# EAGLE design 8x8matrix_tlc_alt (EAGLE 6.5.0)
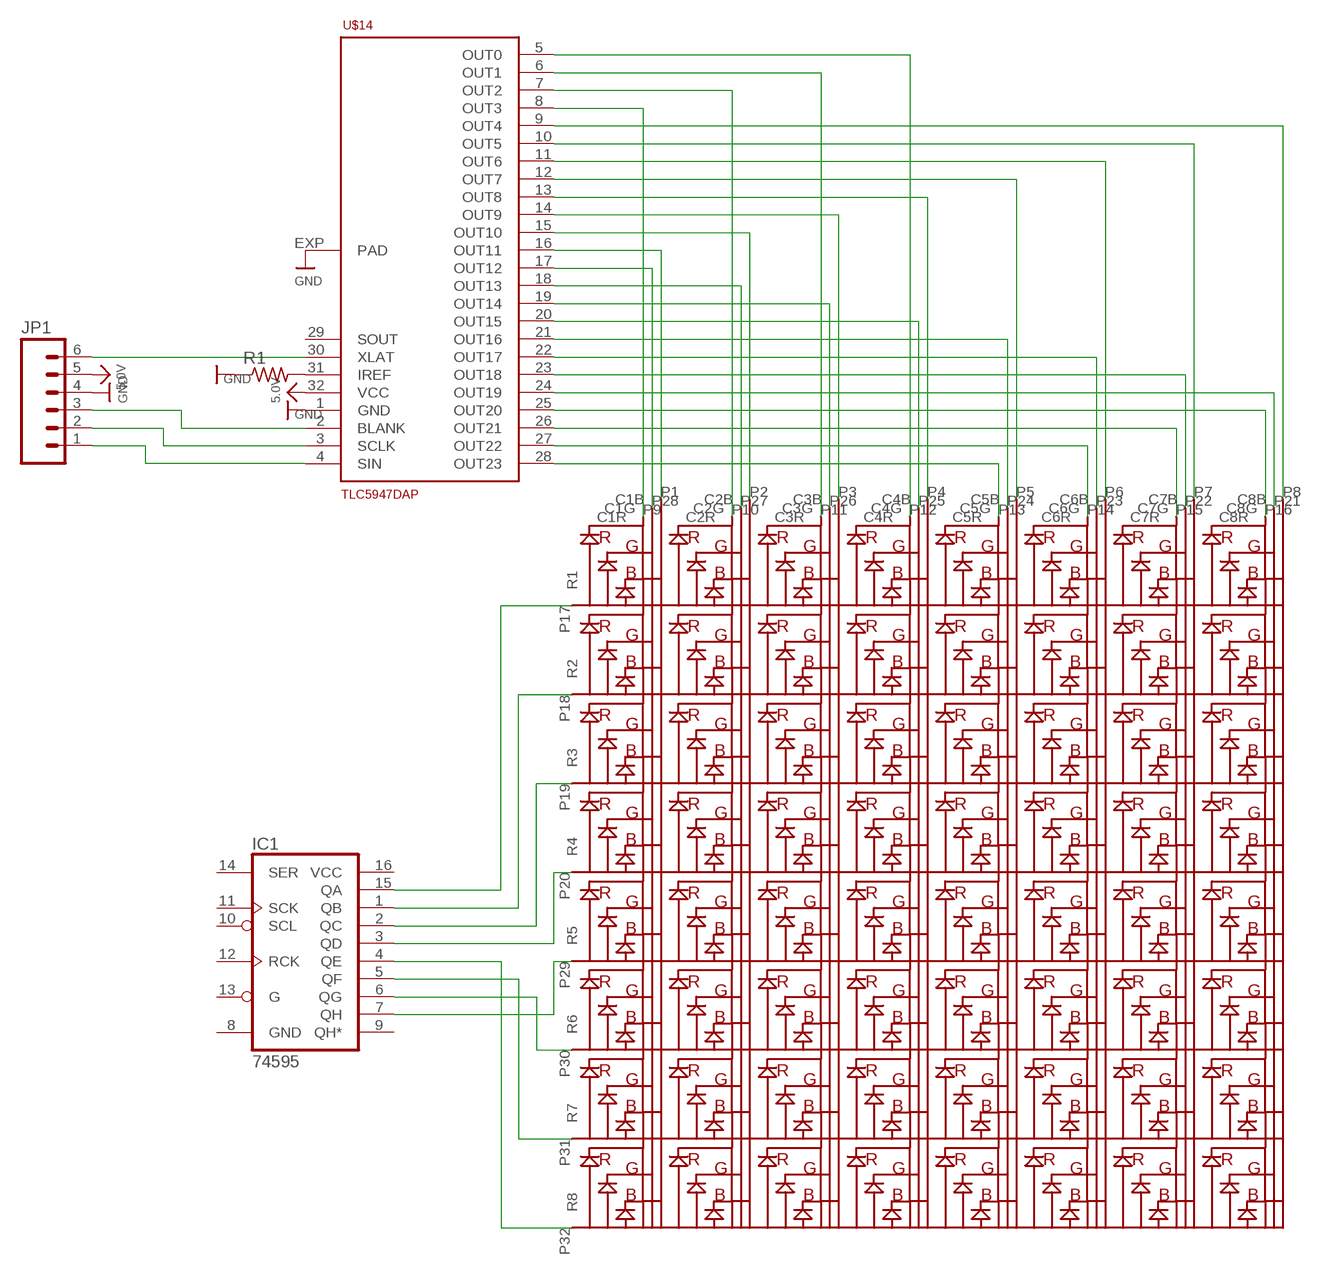
[diagram p0: schematic, sheet 1]

## Parts
IC1  74595  [TSSOP16]
JP1  M06SIP  [1X06]
R1  R-US_R0805  [R0805]
U$1  GTM2088ARGB  [8X8MATRIX]
U$14  TLC5947DAP  [HTSSOP32DAP]

## Nets
5.0V: JP1.5 U$14.32(VCC)
BLANK: JP1.3 U$14.2(BLANK)
GND: JP1.4 R1.1 U$14.1(GND) U$14.EXP(PAD)
N$1: U$1.P1(C1B) U$14.16(OUT11)
N$2: U$1.P2(C2B) U$14.15(OUT10)
N$3: U$1.P3(C3B) U$14.14(OUT9)
N$4: U$1.P4(C4B) U$14.13(OUT8)
N$5: U$1.P5(C5B) U$14.12(OUT7)
N$6: U$1.P6(C6B) U$14.11(OUT6)
N$7: U$1.P7(C7B) U$14.10(OUT5)
N$8: U$1.P8(C8B) U$14.9(OUT4)
N$9: U$1.P9(C1R) U$14.8(OUT3)
N$10: U$1.P10(C2R) U$14.7(OUT2)
N$11: U$1.P11(C3R) U$14.6(OUT1)
N$12: U$1.P12(C4R) U$14.5(OUT0)
N$13: U$1.P13(C5R) U$14.28(OUT23)
N$14: U$1.P14(C6R) U$14.27(OUT22)
N$15: U$1.P15(C7R) U$14.26(OUT21)
N$16: U$1.P16(C8R) U$14.25(OUT20)
N$17: U$1.P28(C1G) U$14.17(OUT12)
N$18: U$1.P27(C2G) U$14.18(OUT13)
N$19: U$1.P26(C3G) U$14.19(OUT14)
N$20: U$1.P25(C4G) U$14.20(OUT15)
N$21: U$1.P24(C5G) U$14.21(OUT16)
N$22: U$1.P23(C6G) U$14.22(OUT17)
N$23: U$1.P22(C7G) U$14.23(OUT18)
N$24: U$1.P21(C8G) U$14.24(OUT19)
N$25: IC1.7(QH) U$1.P29(R5)
N$26: IC1.1(QB) U$1.P18(R2)
N$27: R1.2 U$14.31(IREF)
N$28: JP1.2 U$14.3(SCLK)
N$29: IC1.15(QA) U$1.P17(R1)
N$30: IC1.6(QG) U$1.P30(R6)
N$31: IC1.2(QC) U$1.P19(R3)
N$32: IC1.3(QD) U$1.P20(R4)
N$33: IC1.5(QF) U$1.P31(R7)
N$34: IC1.4(QE) U$1.P32(R8)
SIN: JP1.1 U$14.4(SIN)
XLAT: JP1.6 U$14.30(XLAT)
Unconnected: IC1.9(QH*) IC1.10(SCL) IC1.11(SCK) IC1.12(RCK) IC1.13(G) IC1.14(SER) U$14.29(SOUT)

## Power pins joined to a net without a drawn wire
GND: IC1.8(GND)
VCC: IC1.16(VCC)

## Library data of the parts
IC1 = SparkFun-DigitalIC:74*595: 8-bit SHIFT REGISTER, output latch
JP1 = SparkFun-Connectors:M06: Header 6 Standard 6-pin 0.1" header. Use with straight break away headers (SKU : PRT-00116), right angle break away headers (PRT-00553), swiss pins (PRT-00743), machine pins (PRT-00117), and female headers (PRT-00115). Molex polarized connector foot print use with SKU : PRT-08094 with associated crimp pins and housings. NOTES ON THE VARIANTS LOCK and LOCK_LONGPADS... This footprint was designed to help hold the alignment of a through-hole component (i.e. 6-pin header) while soldering it into place. You may notice that each hole has been shifted either up or down by 0.005 of an inch from it's more standard position (which is a perfectly straight line). This slight alteration caused the pins (the squares in the middle) to touch the edges of the holes. Because they are alternating, it causes a "brace" to hold the component in place. 0.005 has proven to be the perfect amount of "off-center" position when using our standard breakaway headers. Although looks a little odd when you look at the bare footprint, once you have a header in there, the alteration is very hard to notice. Also,if you push a header all the way into place, it is covered up entirely on the bottom side. This idea of altering the position of holes to aid alignment will be further integrated into the Sparkfun Library for other footprints. It can help hold any component with 3 or more connection pins.
R1 = resistor:R-US_: RESISTOR, American symbol
U$1 = mylib:GTM2088ARGB: a 8x8 RGB matrix
U$14 = TLC5947:TLC5947

## Board
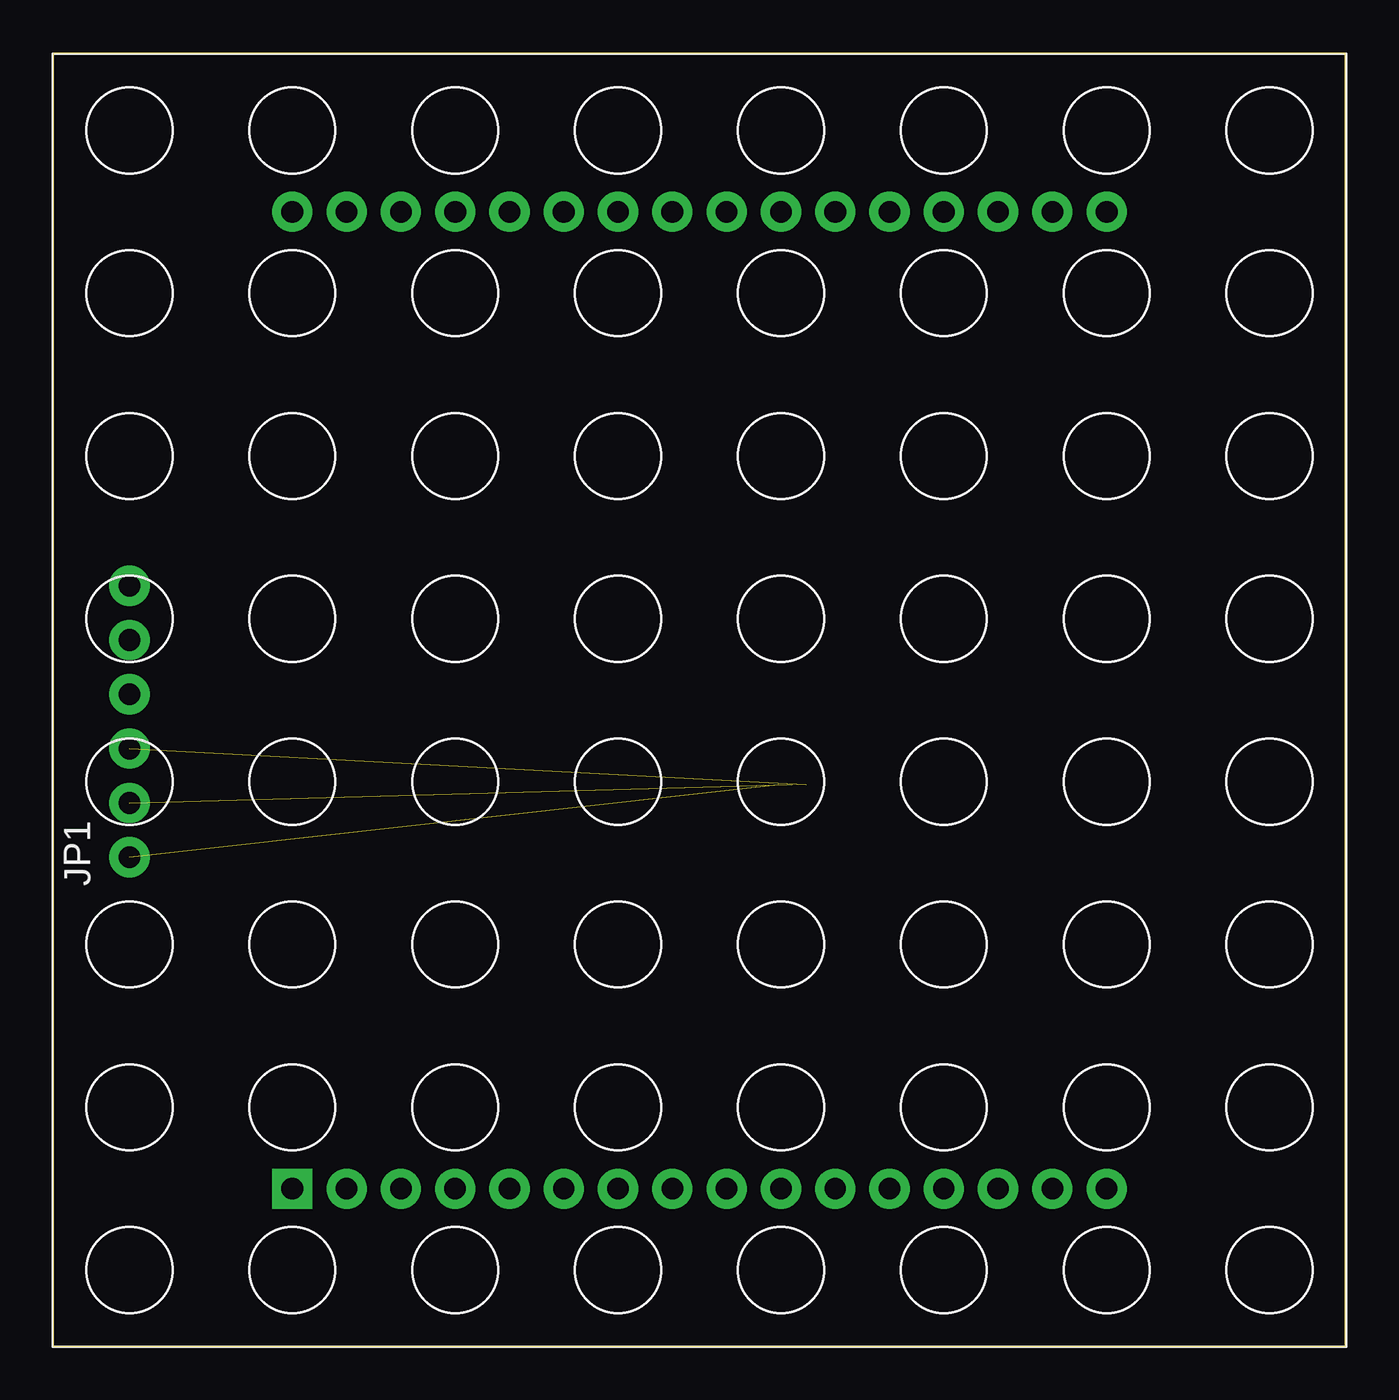
[diagram p1: board, top side]
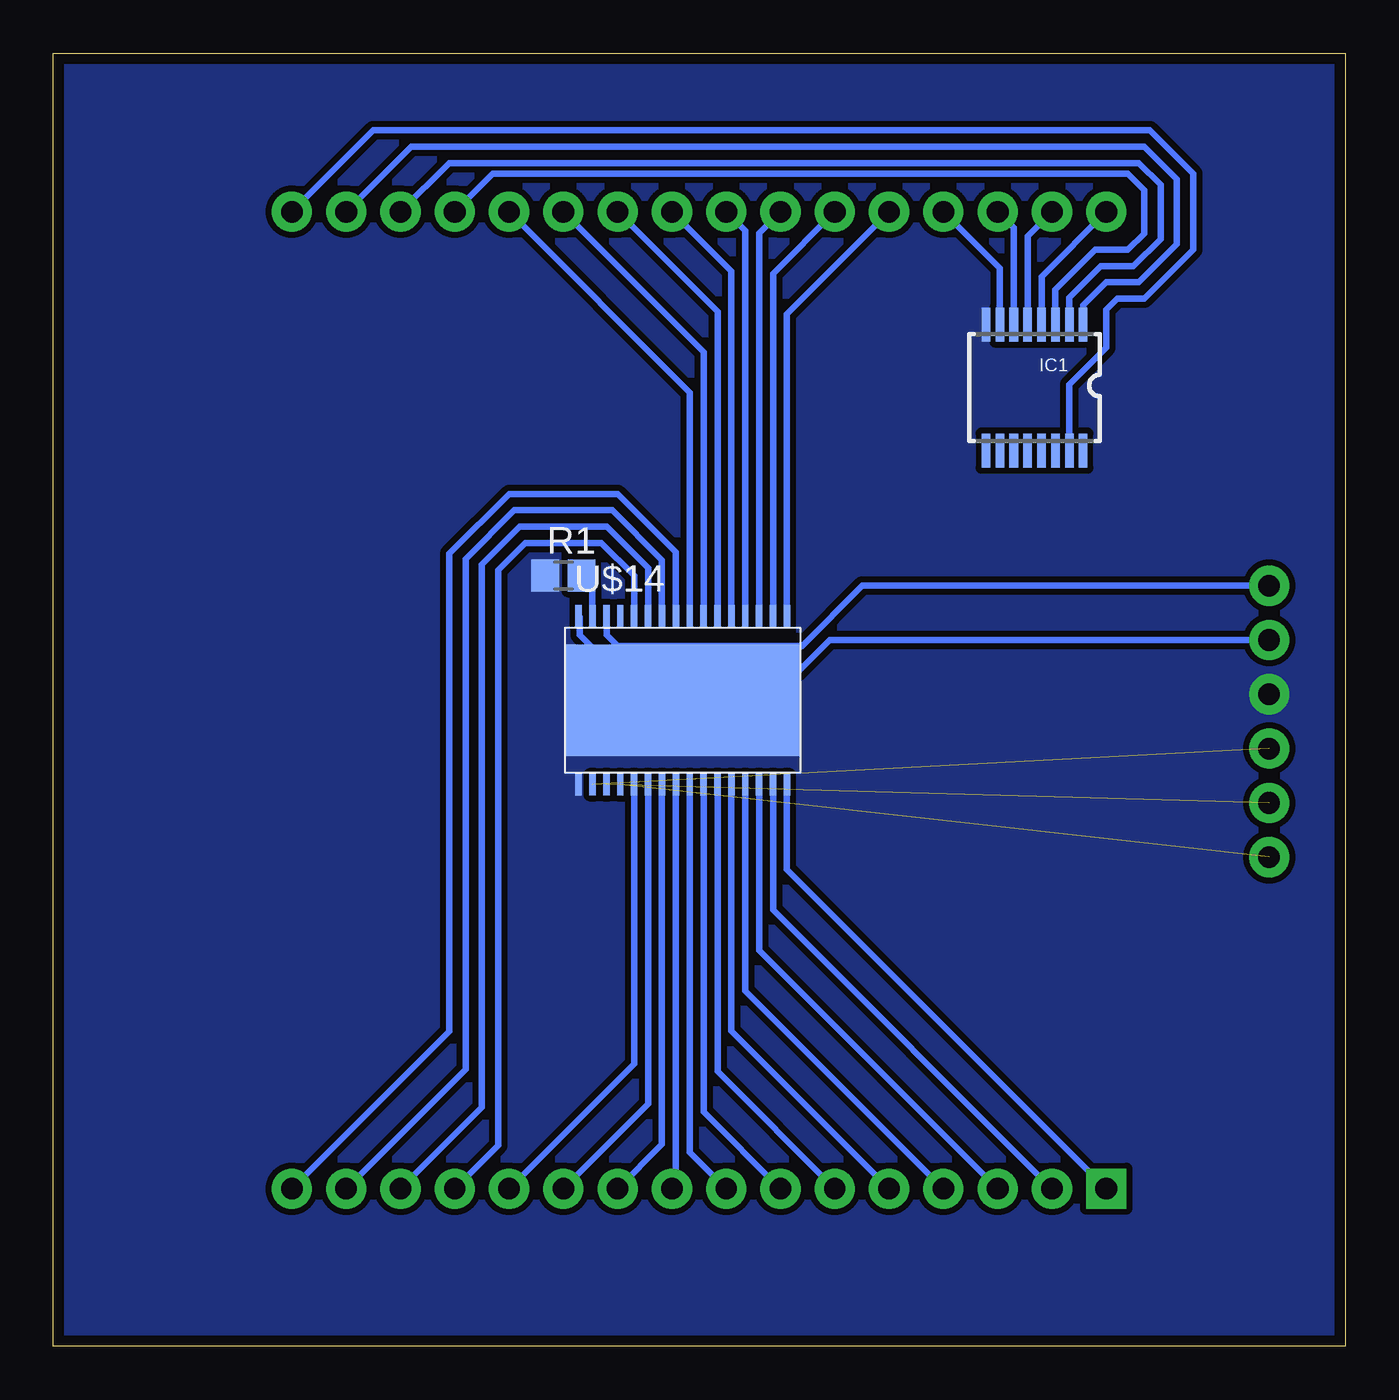
[diagram p2: board, bottom side, seen from below]

Size 60.43 x 60.5 mm. Coordinates in mm from the lower left corner, seen from the top.
Outline: 0,0 60.43,0 60.43,60.5 0,60.5 0,0
Copper layers (1*16): Top 0.035mm / dielectric 1.5mm / Bottom 0.035mm
Design rules "default *": minimum track width 10mil, minimum drill 24mil, track to track 8mil, track to pad 8mil, pad to pad 8mil, via to via 8mil, smd to smd 8mil, copper to edge 20mil, drill to drill 8mil, minimum pad ring 10mil, minimum via ring 8mil, stop-mask expansion 4mil, vias tented up to drill 0mil, thermal gap 10mil

### Footprints (pad centres in the part's own frame; a part is rotated, then mirrored left to right if it is on the bottom)
TSSOP16 = smd 0.4 x 1.6: 1 -2.225,-2.85; 2 -1.575,-2.85; 3 -0.925,-2.85; 4 -0.275,-2.85; 5 0.375,-2.85; 6 1.025,-2.85; 7 1.675,-2.85; 8 2.325,-2.85; 9 2.325,3.05; 10 1.675,3.05; 11 1.025,3.05; 12 0.375,3.05; 13 -0.275,3.05; 14 -0.925,3.05; 15 -1.575,3.05; 16 -2.225,3.05
1X06 = drill 1.016 pad 1.88: 1 0,0; 2 2.54,0; 3 5.08,0; 4 7.62,0; 5 10.16,0; 6 12.7,0
R0805 = smd 1.3 x 1.5: 1 -0.85,0; 2 0.85,0
8X8MATRIX = drill 1.016 pad 1.88 square: P1 -19.05,-22.86 | drill 1.016 pad 1.88: P2 -16.51,-22.86; P3 -13.97,-22.86; P17 19.05,22.86; P18 16.51,22.86; P19 13.97,22.86; P20 11.43,22.86; P21 8.89,22.86; P22 6.35,22.86; P23 3.81,22.86; P24 1.27,22.86; P25 -1.27,22.86; P26 -3.81,22.86; P27 -6.35,22.86; P28 -8.89,22.86; P29 -11.43,22.86; P30 -13.97,22.86; P31 -16.51,22.86; P32 -19.05,22.86 | drill 1 pad 1.88: P4 -11.43,-22.86; P5 -8.89,-22.86; P6 -6.35,-22.86; P7 -3.81,-22.86; P8 -1.27,-22.86; P9 1.27,-22.86; P10 3.81,-22.86; P11 6.35,-22.86; P12 8.89,-22.86; P13 11.43,-22.86; P14 13.97,-22.86; P15 16.51,-22.86; P16 19.05,-22.86
HTSSOP32DAP = smd 0.3 x 1: 1 -4.875,-3.95; 2 -4.225,-3.95; 3 -3.575,-3.95; 4 -2.925,-3.95; 5 -2.275,-3.95; 6 -1.625,-3.95; 7 -0.975,-3.95; 8 -0.325,-3.95; 9 0.325,-3.95; 10 0.975,-3.95; 11 1.625,-3.95; 12 2.275,-3.95; 13 2.925,-3.95; 14 3.575,-3.95; 15 4.225,-3.95; 16 4.875,-3.95; 17 4.875,3.95; 18 4.225,3.95; 19 3.575,3.95; 20 2.925,3.95; 21 2.275,3.95; 22 1.625,3.95; 23 0.975,3.95; 24 0.325,3.95; 25 -0.325,3.95; 26 -0.975,3.95; 27 -1.625,3.95; 28 -2.275,3.95; 29 -2.925,3.95; 30 -3.575,3.95; 31 -4.225,3.95; 32 -4.875,3.95 | smd 11 x 5.2: EXP 0,0

### Placement (x,y rotation side)
IC1  14.48,44.96 180 bottom
JP1  3.56,22.88 90 top
R1  36.58,36.07 0 bottom
U$1  30.23,30.23 0 top
U$14  30.99,30.23 0 bottom

### Tracks (layer width: path | path; a pad name or v marks a point on that pad's centre or on a via)
5.0V
  Bottom 0.305: JP1.5 24.11,33.04 25.65,31.5 34.04,31.5 35.81,33.27 35.81,34.13 U$14.32
BLANK  (1 unrouted)
GND
  pour Bottom (isolate 0.279, no thermals): 0,60.5 0,0 60.45,0 60.45,60.5
N$1
  Bottom 0.305: U$14.16 26.11,22.3 U$1.P1
N$2
  Bottom 0.305: U$14.15 26.76,20.41 U$1.P2
N$3
  Bottom 0.305: U$14.14 27.41,18.52 U$1.P3
N$4
  Bottom 0.305: U$14.13 28.06,16.63 U$1.P4
N$5
  Bottom 0.305: U$14.12 28.71,14.74 U$1.P5
N$6
  Bottom 0.305: U$14.11 29.36,12.85 U$1.P6
N$7
  Bottom 0.305: U$14.10 30.01,10.96 U$1.P7
N$8
  Bottom 0.305: U$14.9 30.66,9.07 U$1.P8
N$9
  Bottom 0.305: U$14.8 31.31,7.55 U$1.P9
N$10
  Bottom 0.305: U$14.7 31.96,9.44 U$1.P10
N$11
  Bottom 0.305: U$14.6 32.61,11.33 U$1.P11
N$12
  Bottom 0.305: U$14.5 33.26,13.22 U$1.P12
N$13
  Bottom 0.305: U$14.28 33.26,36.06 34.8,37.59 38.35,37.59 39.62,36.32 39.62,9.4 U$1.P13
N$14
  Bottom 0.305: U$14.27 32.61,36.42 34.54,38.35 38.61,38.35 40.39,36.58 40.39,11.18 U$1.P14
N$15
  Bottom 0.305: U$14.26 31.96,36.79 34.29,39.12 38.86,39.12 41.15,36.83 41.15,12.95 U$1.P15
N$16
  Bottom 0.305: U$14.25 31.31,37.16 34.04,39.88 39.12,39.88 41.91,37.08 41.91,14.73 U$1.P16
N$17
  Bottom 0.305: U$14.17 26.11,48.31 U$1.P28
N$18
  Bottom 0.305: U$14.18 26.76,50.2 U$1.P27
N$19
  Bottom 0.305: U$14.19 27.41,52.09 U$1.P26
N$20
  Bottom 0.305: U$14.20 28.06,52.19 U$1.P25
N$21
  Bottom 0.305: U$14.21 28.71,50.3 U$1.P24
N$22
  Bottom 0.305: U$14.22 29.36,48.41 U$1.P23
N$23
  Bottom 0.305: U$14.23 30.01,46.52 U$1.P22
N$24
  Bottom 0.305: U$14.24 30.66,44.63 U$1.P21
N$25
  Bottom 0.305: IC1.7 16.15,50.44 U$1.P29
N$26
  Bottom 0.305: IC1.1 12.25,48.71 11.18,49.78 9.65,49.78 7.87,51.56 7.87,54.61 9.4,56.13 43.69,56.13 U$1.P18
N$27
  Bottom 0.305: U$14.31 35.21,35.47 35.31,35.56 35.31,35.65 R1.2
N$28  (1 unrouted)
N$29
  Bottom 0.305: IC1.15 12.9,45.01 11.18,46.74 11.18,48.51 10.67,49.02 9.4,49.02 7.11,51.31 7.11,54.86 9.14,56.9 45.47,56.9 U$1.P17
N$30
  Bottom 0.305: IC1.6 15.5,52.33 U$1.P30
N$31
  Bottom 0.305: IC1.2 12.9,49.07 11.43,50.55 9.91,50.55 8.64,51.82 8.64,54.36 9.65,55.37 41.91,55.37 U$1.P19
N$32
  Bottom 0.305: IC1.3 13.55,49.44 11.68,51.31 10.16,51.31 9.4,52.07 9.4,54.1 10.16,54.86 39.88,54.86 U$1.P20
N$33
  Bottom 0.305: IC1.5 14.85,51.95 U$1.P31
N$34
  Bottom 0.305: IC1.4 14.2,50.06 U$1.P32
SIN  (1 unrouted)
XLAT
  Bottom 0.305: JP1.6 22.58,35.58 25.4,32.77 34.04,32.77 34.54,33.27 34.54,34.16 U$14.30